# Altium project OH02B10-FF-Concept.PrjPcb
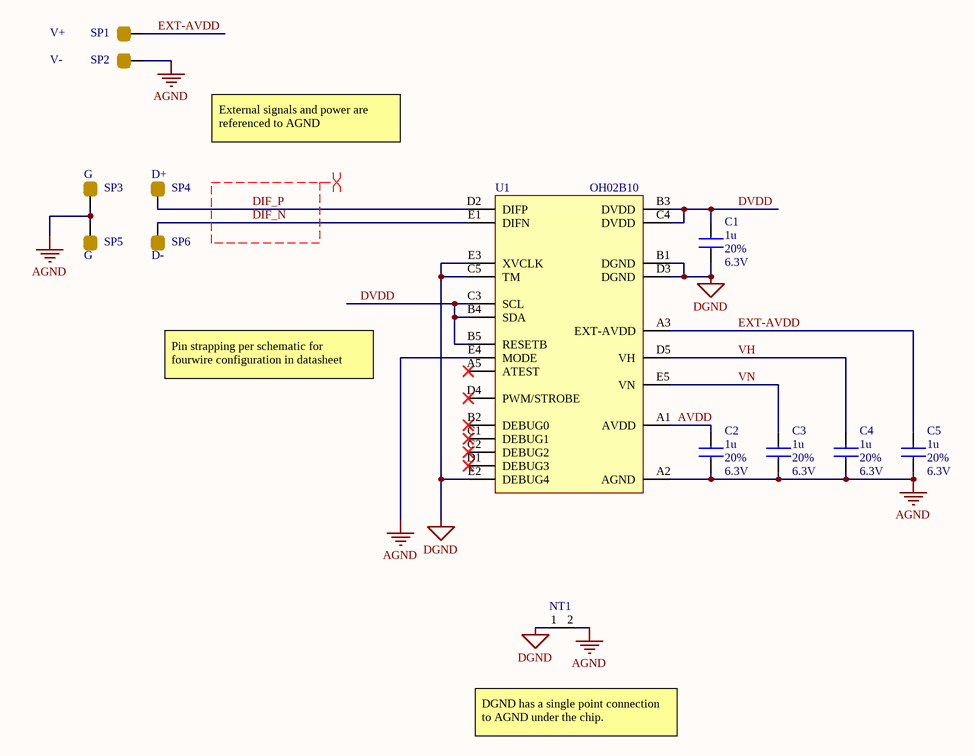
[diagram p0: top-level.SchDoc]
CopyrightString: Copyright (C) 2023 =Customer; Customer: Neptune Medical; PcbaPartNumber: PCBA-2BFF; PcbaPartRevision: X01; PcbaPartTitle: PCBA, OH02B10 Form Factor, Concept; PcbPartNumber: PCB-2BFF; PcbPartRevision: X01; PcbPartTitle: PCB, OH02B10 Form Factor, Concept; SchematicDocNumber: =PcbaPartNumber; SchematicDocRevision: =PcbaPartRevision; SheetTitle: =PcbaPartTitle; zz0_: SOME GUIDELINES BELOW:; zz1_PartNumberGuidelines: XXXX-YYYY-ZZ, where XXXX is PCB or PCBA, YYYY is a unique alphanumeric identifier, and ZZ is a two-digit dash code; zz2_DashcodeGuidelines: Roll the two-digit dash code (ZZ in part number) when a form/fit/function change occurs.; zz3_RevisionGuidelines: Use X01, X02, ... for prerelease/prototype, use A/B/C for release.; zz4_SchematicDocGuidelines: SheetTitle/SchematicDocNumber/SchematicDocRevision: typically reference PcbaPartNumber/Revision variables here, but can use different number depending on client needs
1 sheet, 13 parts. Net scope: global (net labels, ports and power ports of the same name join across sheets).
Board files: OH02B10-FF-Concept.PcbDoc, OH02B10-FF-Panel.PcbDoc

## Sheet top-level.SchDoc: =PcbaPartTitle
size Letter; Organization: Cove Technology Consulting LLC; Address1: 120 W Dayton St; Address2: STE B-3; Address3: Edmonds WA 98020; DocumentNumber: PCBA-2BFF; Revision: X01; SheetNumber: 1; SheetTotal: 1

### Parts
C1  value 1u  Tolerance: 20%  Rating: 6.3V  [CAPC0603X04L]  (hidden comment: GRT033D70J105ME13D)
C2  value 1u  Tolerance: 20%  Rating: 6.3V  [CAPC0603X04L]  (hidden comment: GRT033D70J105ME13D)
C3  value 1u  Tolerance: 20%  Rating: 6.3V  [CAPC0603X04L]  (hidden comment: GRT033D70J105ME13D)
C4  value 1u  Tolerance: 20%  Rating: 6.3V  [CAPC0603X04L]  (hidden comment: GRT033D70J105ME13D)
C5  value 1u  Tolerance: 20%  Rating: 6.3V  [CAPC0603X04L]  (hidden comment: GRT033D70J105ME13D)
NT1  NET_TIE  [NET_TIE_0.15X0.45MM]  (value not drawn)  (net tie, no BOM)
SP1  V+  [SP-0.4x0.4mm]  (no BOM)
SP2  V-  [SP-0.4x0.4mm]  (no BOM)
SP3  G  [SP-0.6x0.6mm]  (no BOM)
SP4  D+  [SP-0.4x0.4mm]  (no BOM)
SP5  G  [SP-0.6x0.6mm]  (no BOM)
SP6  D-  [SP-0.4x0.4mm]  (no BOM)
U1  OH02B10  [BGA24C40P5X5_249X249X52]

### Nets
AGND: C2.2 C3.2 C4.2 C5.2 NT1.2 SP2.1(TP) SP3.1(TP) SP5.1(TP) U1.A2(AGND) U1.E4(MODE)
DGND: C1.2 NT1.1 U1.B1(DGND) U1.C5(TM) U1.D3(DGND) U1.E2(DEBUG4) U1.E3(XVCLK)
AVDD: C2.1 U1.A1(AVDD)
DIF_N: SP6.1(TP) U1.E1(DIFN)
DIF_P: SP4.1(TP) U1.D2(DIFP)
DVDD: C1.1 U1.B3(DVDD) U1.B4(SDA) U1.B5(RESETB) U1.C3(SCL) U1.C4(DVDD)
EXT-AVDD: C5.1 SP1.1(TP) U1.A3(EXT-AVDD)
VH: C4.1 U1.D5(VH)
VN: C3.1 U1.E5(VN)

Not connected (* = marked no-connect by the designer): U1 A5(ATEST)* B2(DEBUG0)* C1(DEBUG1)* C2(DEBUG2)* D1(DEBUG3)* D4(PWM/STROBE)*

### Layout directives
differential pair: DIF_N, DIF_P

### Notes on the sheet
- External signals and power are referenced to AGND
- Pin strapping per schematic for fourwire configuration in datasheet
- DGND has a single point connection to AGND under the chip.
- ECAD by:
- Customer:
- Title:
- Doc Number:
- Date:
- Time:
- Sheet
- Rev:
- of
- CONFIDENTIAL AND PROPRIETARY INFORMATION. USE OR DUPLICATION WITHOUT WRITTEN PERMISSION FROM CUSTOMER OR COVE TECHNOLOGY CONSULTING LLC IS FORBIDDEN.
- File:
- Size:
- Letter

### Library data of the parts
C1-C5 = CMP-001-00049-3: CAP CER 1UF 6.3V X7T 0201
NT1 = CMP-077-000001-2: Source: Cove-NonComp.SchLib; Design Item ID: NET_TIE
SP1-SP6 = CMP-00022-2: Solder Pad
U1 = CMP-00021-2: CMOS Image Sensor, Color, 2MP, 1500x1500, 1/7.5"; Manufacturer Part Number 1: OH02B10-A24A-001A; Manufacturer 1: Omnivision; Value: OH02B10